# Altium schematic sheet mcu.SchDoc
size A4
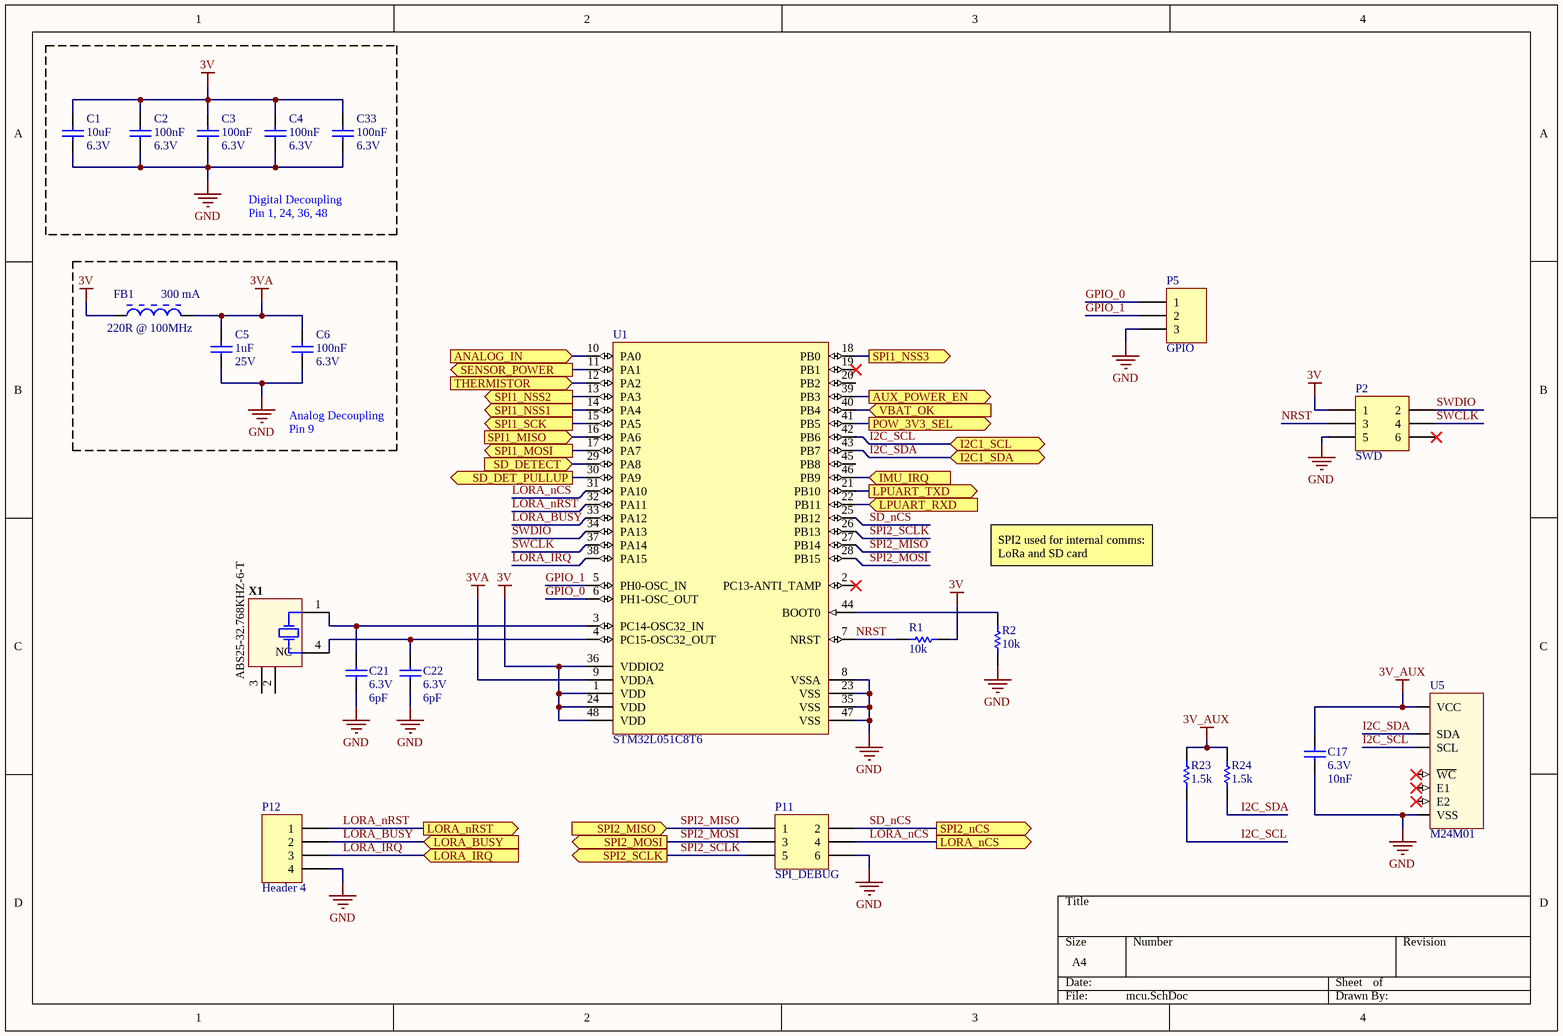
[diagram p0: mcu.SchDoc]

## Parts
C1  value 10uF  Voltage: 6.3V  [0603 (1608M)]  (hidden comment: Cap)
C2  value 100nF  Voltage: 6.3V  [0603 (1608M)]  (hidden comment: Cap)
C3  value 100nF  Voltage: 6.3V  [0603 (1608M)]  (hidden comment: Cap)
C4  value 100nF  Voltage: 6.3V  [0603 (1608M)]  (hidden comment: Cap)
C5  value 1uF  Voltage: 25V  [0603 (1608M)]  (hidden comment: Cap)
C6  value 100nF  Voltage: 6.3V  [0603 (1608M)]  (hidden comment: Cap)
C17  value 10nF  Voltage: 6.3V  [0603 (1608M)]  (hidden comment: Cap)
C21  value 6pF  Voltage: 6.3V  [0603 (1608M)]  (hidden comment: Cap)
C22  value 6pF  Voltage: 6.3V  [0603 (1608M)]  (hidden comment: Cap)
C33  value 100nF  Voltage: 6.3V  [0603 (1608M)]  (hidden comment: Cap)
FB1  Rated Current: 300 mA  Parameter 1: 220R @ 100MHz  [MURA-BLM15-CHIP-2_V]  (hidden comment: BLM15GG221SN1D)
P2  SWD  [HDR2X3]
P5  GPIO  [HDR1X3]
P11  SPI_DEBUG  [HDR2X3]
P12  Header 4  [HDR1X4]
R1  value 10k  [0603 (1608M)]  (hidden comment: Resistor)
R2  value 10k  [0603 (1608M)]  (hidden comment: Resistor)
R23  value 1.5k  [0603 (1608M)]  (hidden comment: Resistor)
R24  value 1.5k  [0603 (1608M)]  (hidden comment: Resistor)
U1  STM32L051C8T6  [STM-LQFP48_L]
U5  M24M01  [TSSOP-8]
X1  ABS25-32.768KHZ-6-T  [ABRA-ABS25-4_V]

## Ports
ANALOG_IN (in), AUX_POWER_EN (out), I2C1_SCL (bidir), I2C1_SDA (bidir), IMU_IRQ (in), LORA_BUSY (in), LORA_IRQ (in), LORA_nCS (out), LORA_nRST (out), LPUART_RXD (in), LPUART_TXD (out), POW_3V3_SEL (out), SD_DET_PULLUP (out), SD_DETECT (in), SENSOR_POWER (out), SPI1_MISO (in), SPI1_MOSI (out), SPI1_NSS1 (out), SPI1_NSS2 (out), SPI1_NSS3 (out), SPI1_SCK (out), SPI2_MISO (in), SPI2_MOSI (out), SPI2_nCS (out), SPI2_SCLK (out), THERMISTOR (in), VBAT_OK (in)

## Nets
3V: C1.2 C2.2 C3.2 C4.2 C33.2 FB1.2 P2.1 R1.1 U1.1(VDD) U1.24(VDD) U1.36(VDDIO2) U1.48(VDD)
3V_AUX: C17.2 R23.2 R24.2 U5.8(VCC)
3VA: C5.2 C6.2 FB1.1 U1.9(VDDA)
GND: C1.1 C2.1 C3.1 C4.1 C5.1 C6.1 C17.1 C21.1 C22.1 C33.1 P2.5 P5.3 P11.6 P12.4 R2.1 U1.8(VSSA) U1.23(VSS) U1.35(VSS) U1.47(VSS) U5.4(VSS)
ANALOG_IN: U1.10(PA0) ; port ANALOG_IN
AUX_POWER_EN: U1.39(PB3) ; port AUX_POWER_EN
GPIO_0: P5.1 U1.6(PH1-OSC_OUT)
GPIO_1: P5.2 U1.5(PH0-OSC_IN)
I2C_SCL: R23.1 U1.42(PB6) U5.6(SCL) ; port I2C1_SCL
I2C_SDA: R24.1 U1.43(PB7) U5.5(SDA) ; port I2C1_SDA
IMU_IRQ: U1.46(PB9) ; port IMU_IRQ
LORA_BUSY: P12.2 U1.33(PA12) ; port LORA_BUSY
LORA_IRQ: P12.3 U1.38(PA15) ; port LORA_IRQ
LORA_nCS: P11.4 U1.31(PA10) ; port LORA_nCS
LORA_nRST: P12.1 U1.32(PA11) ; port LORA_nRST
LPUART_RXD: U1.22(PB11) ; port LPUART_RXD
LPUART_TXD: U1.21(PB10) ; port LPUART_TXD
NRST: P2.3 R1.2 U1.7(NRST)
POW_3V3_SEL: U1.41(PB5) ; port POW_3V3_SEL
SD_DET_PULLUP: U1.30(PA9) ; port SD_DET_PULLUP
SD_DETECT: U1.29(PA8) ; port SD_DETECT
SD_nCS: P11.2 U1.25(PB12) ; port SPI2_nCS
SENSOR_POWER: U1.11(PA1) ; port SENSOR_POWER
SPI1_MISO: U1.16(PA6) ; port SPI1_MISO
SPI1_MOSI: U1.17(PA7) ; port SPI1_MOSI
SPI1_NSS1: U1.14(PA4) ; port SPI1_NSS1
SPI1_NSS2: U1.13(PA3) ; port SPI1_NSS2
SPI1_NSS3: U1.18(PB0) ; port SPI1_NSS3
SPI1_SCK: U1.15(PA5) ; port SPI1_SCK
SPI2_MISO: P11.1 U1.27(PB14) ; port SPI2_MISO
SPI2_MOSI: P11.3 U1.28(PB15) ; port SPI2_MOSI
SPI2_SCLK: P11.5 U1.26(PB13) ; port SPI2_SCLK
SWCLK: P2.4 U1.37(PA14)
SWDIO: P2.2 U1.34(PA13)
THERMISTOR: U1.12(PA2) ; port THERMISTOR
VBAT_OK: U1.40(PB4) ; port VBAT_OK
NetC21_2: C21.2 U1.3(PC14-OSC32_IN) X1.1(X1)
NetC22_2: C22.2 U1.4(PC15-OSC32_OUT) X1.4(X2)
NetR2_2: R2.2 U1.44(BOOT0)

Not connected (* = marked no-connect by the designer): P2 6*; U1 2(PC13-ANTI_TAMP)* 19(PB1)* 20(PB2) 45(PB8); U5 2(E1)* 3(E2)* 7(~{WC})*; X1 2(NC) 3(NC)

## Notes on the sheet
- Digital Decoupling
- Pin 1, 24, 36, 48
- Analog Decoupling
- Pin 9
- SPI2 used for internal comms:
  LoRa and SD card

## Library data of the parts
C1-C6 C17 C21 C22 C33 = Cap: Capacitor
FB1 = CMP-0686-00164-3: Chip Ferrite Bead for High-GHz Band General Use, 220 Ohm, 300 mA, -55 to 125 degC, 1 x 0.5 x 0.55 mm SMD, Tape and Reel; Manufacturer: Murata; DC Resistance: 0.7 Ohm Max.; Impedance (at 100 MHz): 220 Ohm +/- 25%; PackageDescription: 2-Pin Chip, Body 1 x 0.5 mm; PartNumber: BLM15GG221SN1D; PackageReference: BLM15-2; ComponentLink3URL: http://www.murata.com/products/catalog/pdf/c31e.pdf; ComponentLink2URL: http://www.murata.com/products/catalog/pdf/c31e.pdf; ComponentLink2Description: Datasheet; Operating Temperature Range: -55 to 125 degC; ComponentLink1Description: Manufacturer URL; ComponentLink3Description: Package Specification; DatasheetVersion: 08/2013; ComponentLink1URL: http://www.murata.com/; Mounting Technology: Surface Mount; Packing: Tape and Reel
P2 P11 = Header 3X2: Header, 3-Pin, Dual row; LatestRevisionDate: 17-Jul-2002; LatestRevisionNote: Re-released for DXP Platform.; Publisher: Altium Limited
P5 = Header 3: Header, 3-Pin; LatestRevisionDate: 17-Jul-2002; LatestRevisionNote: Re-released for DXP Platform.; Publisher: Altium Limited
P12 = Header 4: Header, 4-Pin; LatestRevisionDate: 17-Jul-2002; LatestRevisionNote: Re-released for DXP Platform.; Publisher: Altium Limited
R1 R2 R23 R24 = Resistor: Tolerance: 5%; Published: 8-Jun-2000; LatestRevisionDate: 17-Jul-2002; LatestRevisionNote: Re-released for DXP Platform.; PackageReference: AXIAL-0.3; Publisher: Altium Limited; PackageDescription: Axial Device, Thru-Hole; 2 Leads; 0.3 in Pin Spacing
U1 = CMP-1546-00003-1: Ultra-Low-Power ARM Cortex-M0+ MCU, 64 KB Flash, 1.8 to 3.6 V, -40 to 85 degC, 48-Pin LQFP, RoHS, Tray; RAM: 8 KB; Flash: 64 KB; Data EEPROM: 2 KB; VDD Max: 3.6 V; VDD Min: 1.8 V; PartNumber: STM32L051C8T6; ComponentLink3URL: http://www.st.com/st-web-ui/static/active/en/resource/technical/document/datasheet/DM00058181.pdf; ComponentLink1URL: http://www.st.com/web/en/home.html; Temperature Min: -40 degC; DatasheetVersion: Rev. 4; ComponentLink3Description: Package Specification; Mounting Technology: Surface Mount; ComponentLink1Description: Manufacturer URL; Packing: Tray; Temperature Max: 85 degC; ComponentLink2URL: http://www.st.com/st-web-ui/static/active/en/resource/technical/document/datasheet/DM00108219.pdf; PackageDescription: 48-Pin Frame Chip Scale Package, Body 7 x 7 mm, Pitch 0.5 mm; ComponentLink2Description: Datasheet; RoHS: TRUE
U5 = M24M01: EEPROM Memory IC 1Mb (128K x 8) I²C 1MHz 500ns 8-TSSOP
X1 = CMP-2000-05036-1: Low Frequency Crystal, 32.768 KHz, 6 pF, +/- 20 ppm, -40 to 85 degC, 4-Pin SMD, RoHS, Tape and Reel; Manufacturer: Abracon; Tolerance: 20PPM; ESR: 50kOhms; Case Width: 3.8mm; Case Height: 2.5mm; Case Length: 8mm; Load Capacitance: 6pF; Operating Temperature Range: -40Cto+85C; Package Reference: ABS25; Factory Pack Quantity: 3000; Package Description: 4-Pin Surface Mount Device, Body 8 x 3.8 mm, Pitch 5.5 mm; Frequency: 32.768kHz; Termination Style: SMD/SMT; Manufacturer URL: http://www.abracon.com/; Type: LowFrequencyCrystal; Dimensions: 3.8mmWx8mmLx2.5mmH; Product Category: Crystals; Series: ABS25; RoHS: Details; Package / Case: 8mmx3.8mm; Datasheet Version: Jun-17; Brand: ABRACON; Datasheet URL: https://datasheet.ciiva.com/854/abs25-854528.pdf; Packaging: Reel; Mounting Style: SMD/SMT